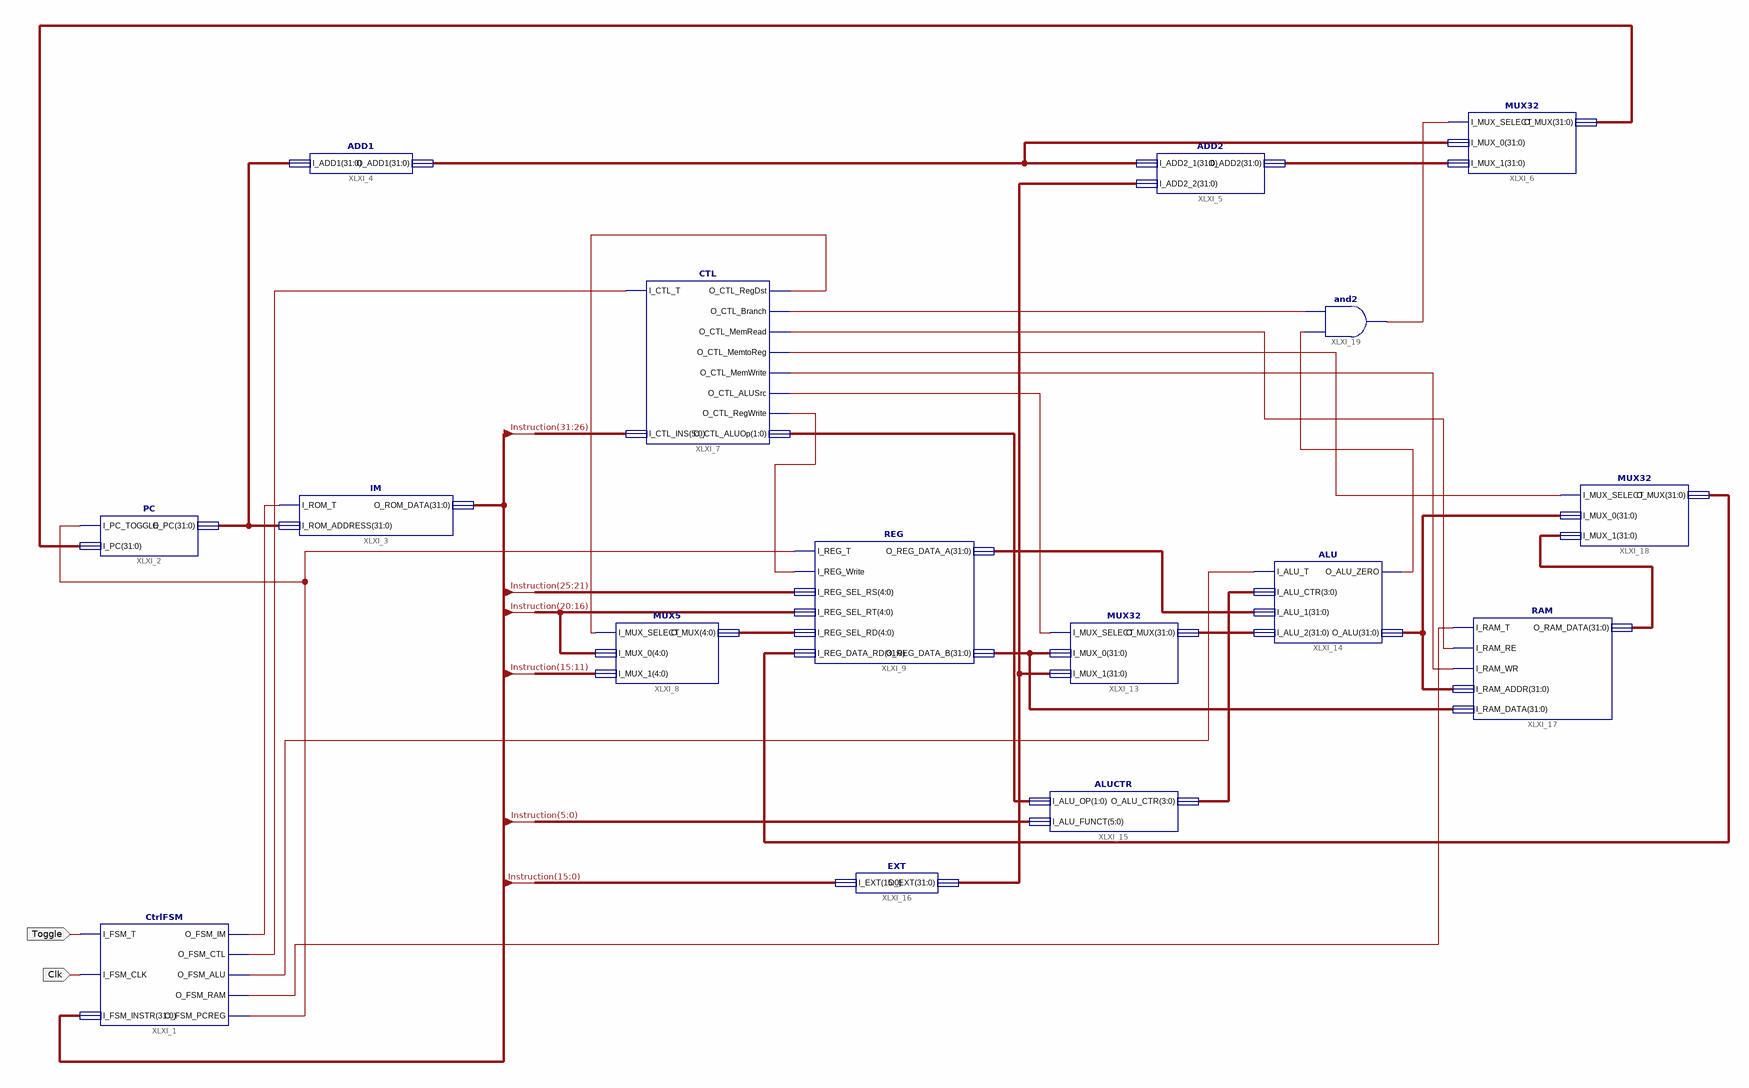
[diagram p0: schematic sheet 1]
// Xilinx ISE schematic MIPS.sch (spartan3e) as structural Verilog: 16 symbols, 2 ports
module MIPS (
  input  Toggle,
  input  Clk
);

  wire XLXN_26, XLXN_27, XLXN_36, XLXN_37, XLXN_46, XLXN_48, XLXN_51, XLXN_53, XLXN_54, XLXN_55, XLXN_58,
       XLXN_60, XLXN_67, XLXN_84;
  wire [1:0] XLXN_61;
  wire [3:0] XLXN_45;
  wire [4:0] XLXN_14;
  wire [31:0] Instruction, XLXN_1, XLXN_32, XLXN_34, XLXN_35, XLXN_41, XLXN_42, XLXN_44, XLXN_68, XLXN_93,
       XLXN_94, XLXN_95;

  CtrlFSM XLXI_1 (
    .I_FSM_T(Toggle), .I_FSM_CLK(Clk), .I_FSM_INSTR(Instruction), .O_FSM_IM(XLXN_26), .O_FSM_CTL(XLXN_27),
    .O_FSM_ALU(XLXN_46), .O_FSM_RAM(XLXN_67), .O_FSM_PCREG(XLXN_84));
  PC XLXI_2 (.I_PC_TOGGLE(XLXN_84), .I_PC(XLXN_35), .O_PC(XLXN_1));
  IM XLXI_3 (.I_ROM_T(XLXN_26), .I_ROM_ADDRESS(XLXN_1), .O_ROM_DATA(Instruction));
  CTL XLXI_7 (
    .I_CTL_T(XLXN_27), .I_CTL_INS(Instruction[31:26]), .O_CTL_RegDst(XLXN_51), .O_CTL_Branch(XLXN_37),
    .O_CTL_MemRead(XLXN_53), .O_CTL_MemtoReg(XLXN_54), .O_CTL_MemWrite(XLXN_58), .O_CTL_ALUSrc(XLXN_55),
    .O_CTL_RegWrite(XLXN_60), .O_CTL_ALUOp(XLXN_61));
  MUX5 XLXI_8 (.I_MUX_SELECT(XLXN_51), .I_MUX_0(Instruction[20:16]), .I_MUX_1(Instruction[15:11]), .O_MUX(XLXN_14));
  REG XLXI_9 (
    .I_REG_T(XLXN_84), .I_REG_Write(XLXN_60), .I_REG_SEL_RS(Instruction[25:21]),
    .I_REG_SEL_RT(Instruction[20:16]), .I_REG_SEL_RD(XLXN_14), .I_REG_DATA_RD(XLXN_93),
    .O_REG_DATA_A(XLXN_44), .O_REG_DATA_B(XLXN_41));
  ADD1 XLXI_4 (.I_ADD1(XLXN_1), .O_ADD1(XLXN_34));
  ADD2 XLXI_5 (.I_ADD2_1(XLXN_34), .I_ADD2_2(XLXN_68), .O_ADD2(XLXN_32));
  MUX32 XLXI_6 (.I_MUX_SELECT(XLXN_36), .I_MUX_0(XLXN_34), .I_MUX_1(XLXN_32), .O_MUX(XLXN_35));
  MUX32 XLXI_13 (.I_MUX_SELECT(XLXN_55), .I_MUX_0(XLXN_41), .I_MUX_1(XLXN_68), .O_MUX(XLXN_42));
  ALU XLXI_14 (
    .I_ALU_T(XLXN_46), .I_ALU_CTR(XLXN_45), .I_ALU_1(XLXN_44), .I_ALU_2(XLXN_42), .O_ALU_ZERO(XLXN_48),
    .O_ALU(XLXN_95));
  ALUCTR XLXI_15 (.I_ALU_OP(XLXN_61), .I_ALU_FUNCT(Instruction[5:0]), .O_ALU_CTR(XLXN_45));
  EXT XLXI_16 (.I_EXT(Instruction[15:0]), .O_EXT(XLXN_68));
  RAM XLXI_17 (
    .I_RAM_T(XLXN_67), .I_RAM_RE(XLXN_53), .I_RAM_WR(XLXN_58), .I_RAM_ADDR(XLXN_95), .I_RAM_DATA(XLXN_41),
    .O_RAM_DATA(XLXN_94));
  MUX32 XLXI_18 (.I_MUX_SELECT(XLXN_54), .I_MUX_0(XLXN_95), .I_MUX_1(XLXN_94), .O_MUX(XLXN_93));
  and XLXI_19 (XLXN_36, XLXN_48, XLXN_37);
endmodule
